# EAGLE design WearablesVCNL4020small (EAGLE 7.5.0)
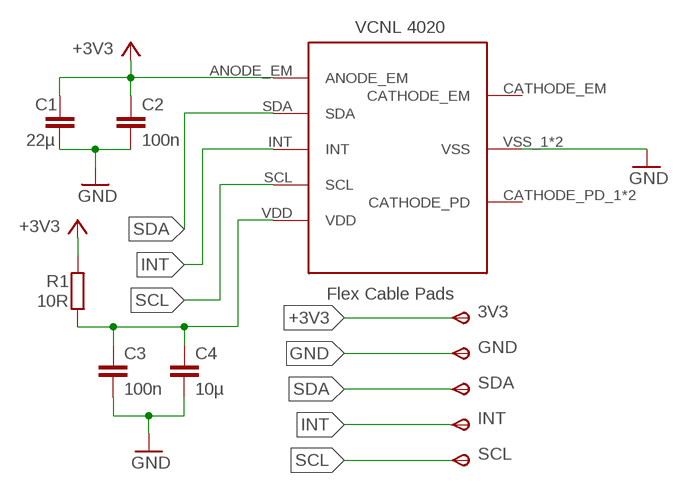
[diagram p0: schematic, sheet 1]

## Parts
3V3  TPSTP08R  [TP08R]
C1  22µ  C-EUC0603  [C0603]
C2  100n  C-EUC0603  [C0603]
C3  100n  C-EUC0603  [C0603]
C4  10µ  C-EUC0603  [C0603]
GND  TPSTP08R  [TP08R]
INT  TPSTP08R  [TP08R]
R1  10R  R-EU_R0603  [R0603]
SCL  TPSTP08R  [TP08R]
SDA  TPSTP08R  [TP08R]
U$1  VCNL4020  [VCNL4020]

## Nets
+3V3: 3V3.TP(PP) C1.1 C2.1 R1.2 U$1.ANODE_EM
GND: C1.2 C2.2 C3.2 C4.2 GND.TP(PP) U$1.VSS_1(VSS) U$1.VSS_2(VSS)
INT: INT.TP(PP) U$1.INT
SCL: SCL.TP(PP) U$1.SCL
SDA: SDA.TP(PP) U$1.SDA
VDD: C3.1 C4.1 R1.1 U$1.VDD
Unconnected: U$1.CATHODE_EM U$1.CATHODE_PD_1(CATHODE_PD) U$1.CATHODE_PD_2(CATHODE_PD)

## Notes on the sheet
- VCNL 4020
- Flex Cable Pads

## Library data of the parts
3V3 GND INT SCL SDA = testpad:TPS: TEST PIN
C1-C4 = rcl:C-EU: CAPACITOR, European symbol
R1 = resistor:R-EU_: RESISTOR, European symbol
U$1 = VCNL4020:VCNL4020

## Board
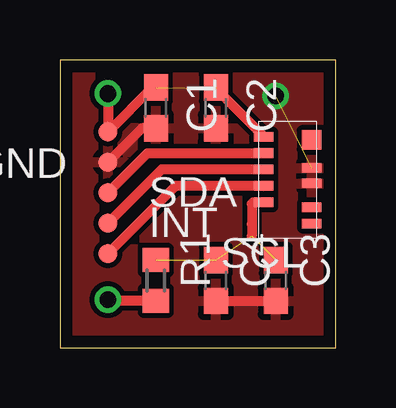
[diagram p1: board, top side]
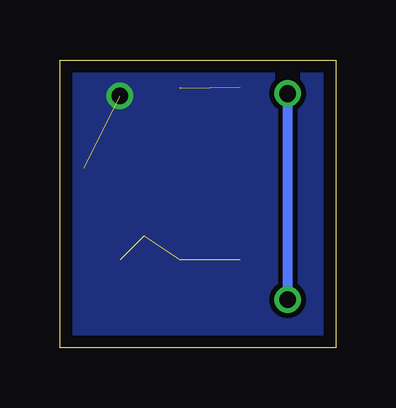
[diagram p2: board, bottom side, seen from below]

Size 11.5 x 12 mm. Coordinates in mm from the lower left corner, seen from the top.
Outline: 0,0 11.5,0 11.5,12 0,12 0,0
Copper layers (1*16): Top 0.035mm / dielectric 1.5mm / Bottom 0.035mm
Design rules "default *": minimum track width 10mil, minimum drill 24mil, track to track 8mil, track to pad 8mil, pad to pad 8mil, via to via 8mil, smd to smd 8mil, copper to edge 20mil, drill to drill 8mil, minimum pad ring 10mil, minimum via ring 8mil, stop-mask expansion 4mil, vias tented up to drill 0mil, thermal gap 10mil

### Footprints (pad centres in the part's own frame; a part is rotated, then mirrored left to right if it is on the bottom)
TP08R = smd 0.8 x 0.8: TP 0,0
C0603 = smd 1.1 x 1: 1 -0.85,0; 2 0.85,0
R0603 = smd 1 x 1.1: 1 -0.85,0; 2 0.85,0
VCNL4020 = smd 0.4 x 0.8: ANODE_EM -1.8,-1; CATHODE_PD_1 1.15,1; CATHODE_PD_2 1.83,1; INT -0.43,-1; SCL 0.255,-1; SDA -1.115,-1; VDD 0.94,-1; VSS_1 -0.5,1; VSS_2 0.15,1 | smd 0.8 x 0.83: CATHODE_EM -1.665,1

### Placement (x,y rotation side)
3V3  2,9 180 top
C1  4,10 270 top
C2  6.5,10 270 top
C3  9,2.8 270 top
C4  6.5,2.8 270 top
GND  2,7.73 180 top
INT  2,5.19 0 top
R1  4,2.8 270 top
SCL  2,3.92 0 top
SDA  2,6.46 0 top
U$1  9.5,7 270 top

### Tracks (layer width: path | path; a pad name or v marks a point on that pad's centre or on a via)
+3V3  (via drill 0.7 pad 0.81)  (2 unrouted)
  Top 0.406: 6.5,10.8 U$1.ANODE_EM | R1.2 2.05,1.95 v2,2 | C1.1 3.85,10.85 3V3.TP v2,10.6
  Bottom 0.406: v2,2 v2,10.6
GND  (via drill 0.7 pad 0.81)  (1 unrouted)
  Top 0.406: C1.2 3.42,9.15 GND.TP | C4.2 C3.2
  other vias: 9,10.5
  pour Top: -0.5,14 13.5,14 13.5,0 -0.5,0
  pour Bottom: -1.5,13 12.5,13 12.5,-1 -1.5,-1
INT
  Top 0.406: U$1.INT 4.24,7.43 INT.TP
SCL
  Top 0.406: U$1.SCL 4.83,6.75 SCL.TP
SDA
  Top 0.406: U$1.SDA 8.48,8.1 3.64,8.1 SDA.TP
VDD  (3 unrouted)
  Top 0.406: U$1.VDD 8.06,6.06 8,6 8,5.15 8,4.65